# Altium project xme0724ioextend.PrjPcb
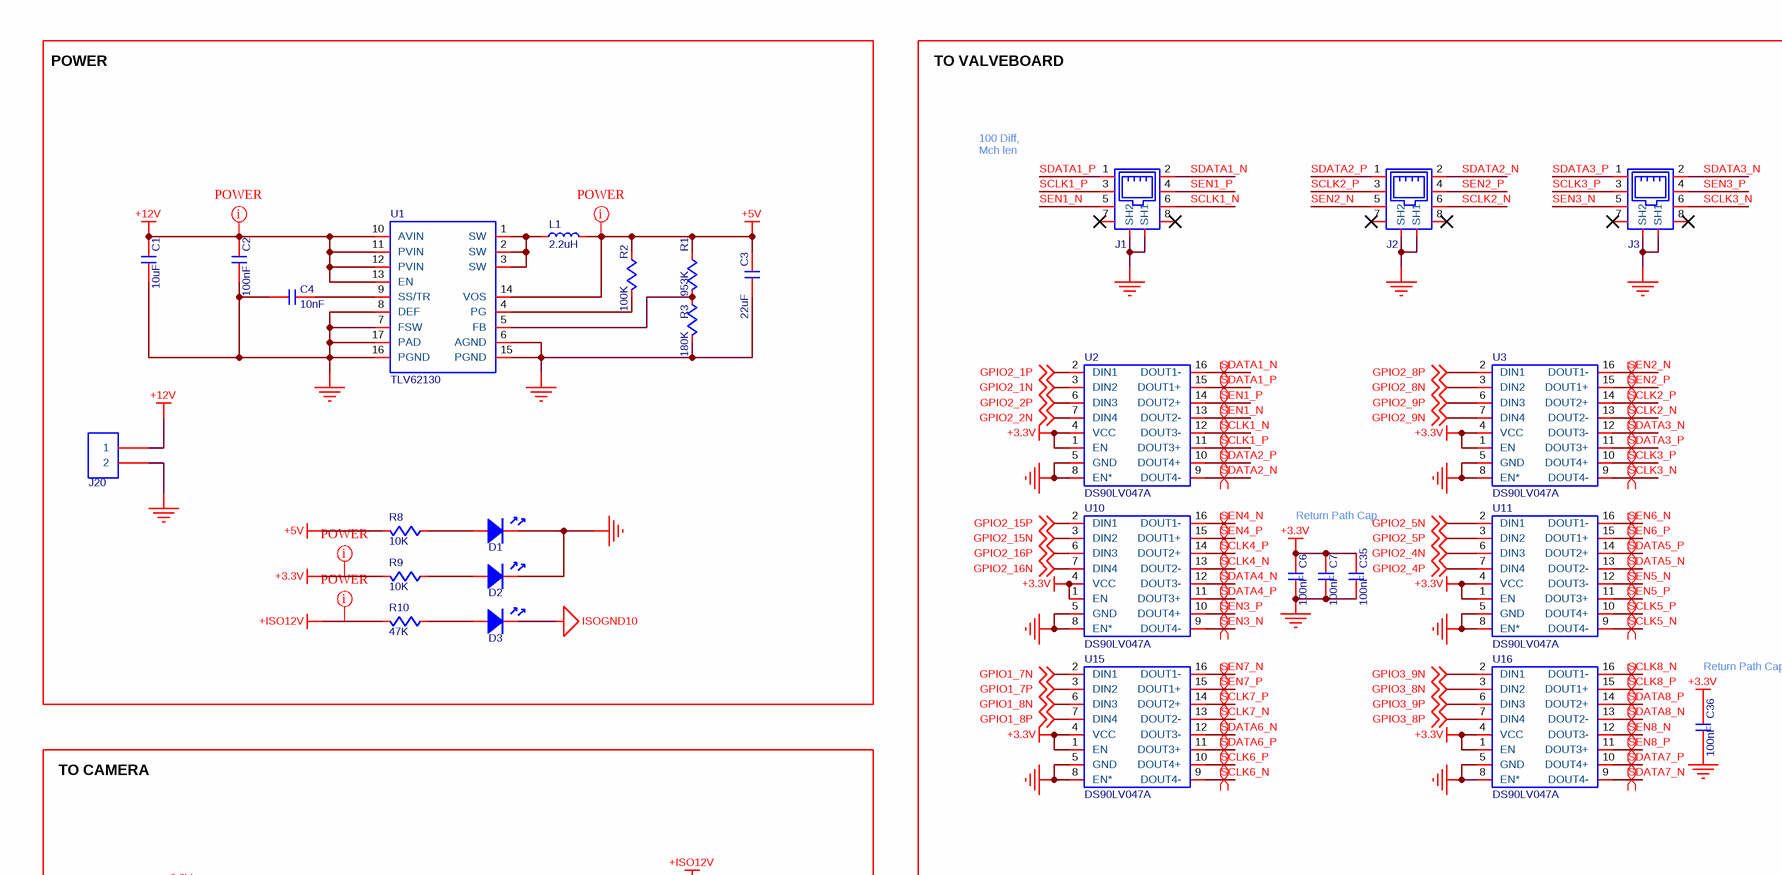
[diagram p0: Sheet.SchDoc, top left]
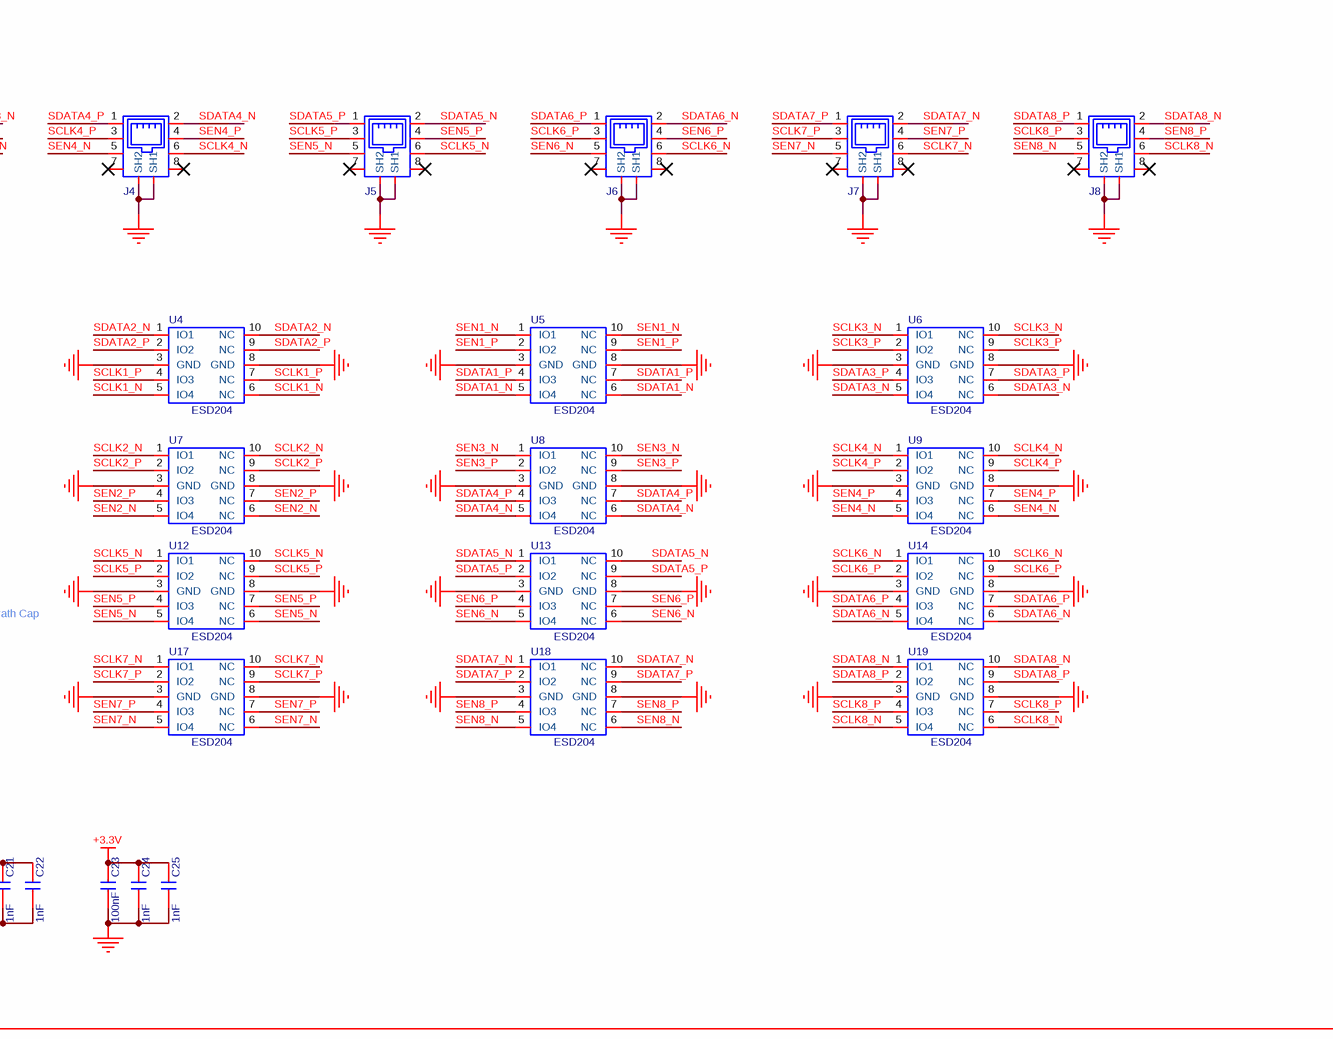
[diagram p1: Sheet.SchDoc, top right]
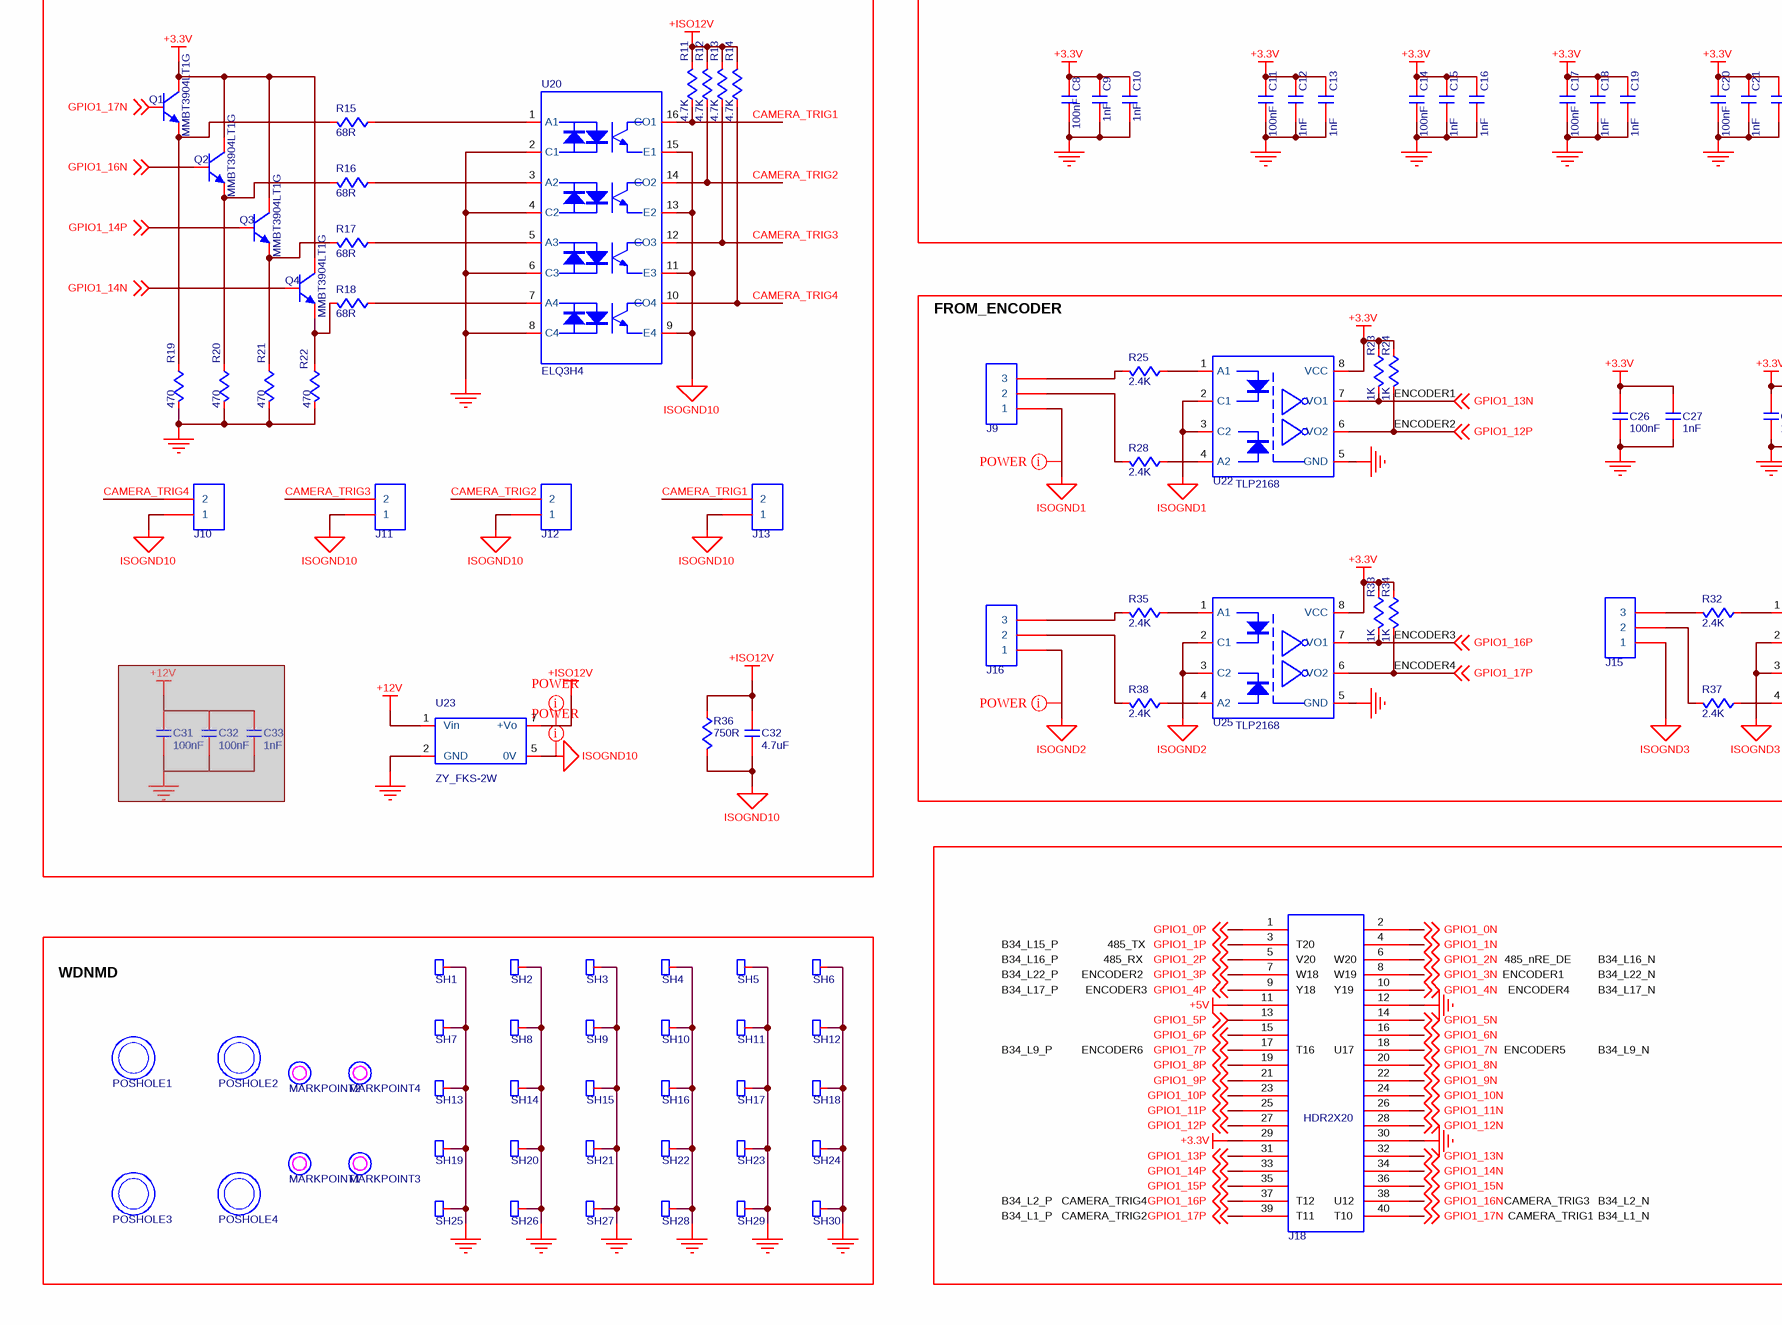
[diagram p2: Sheet.SchDoc, bottom left]
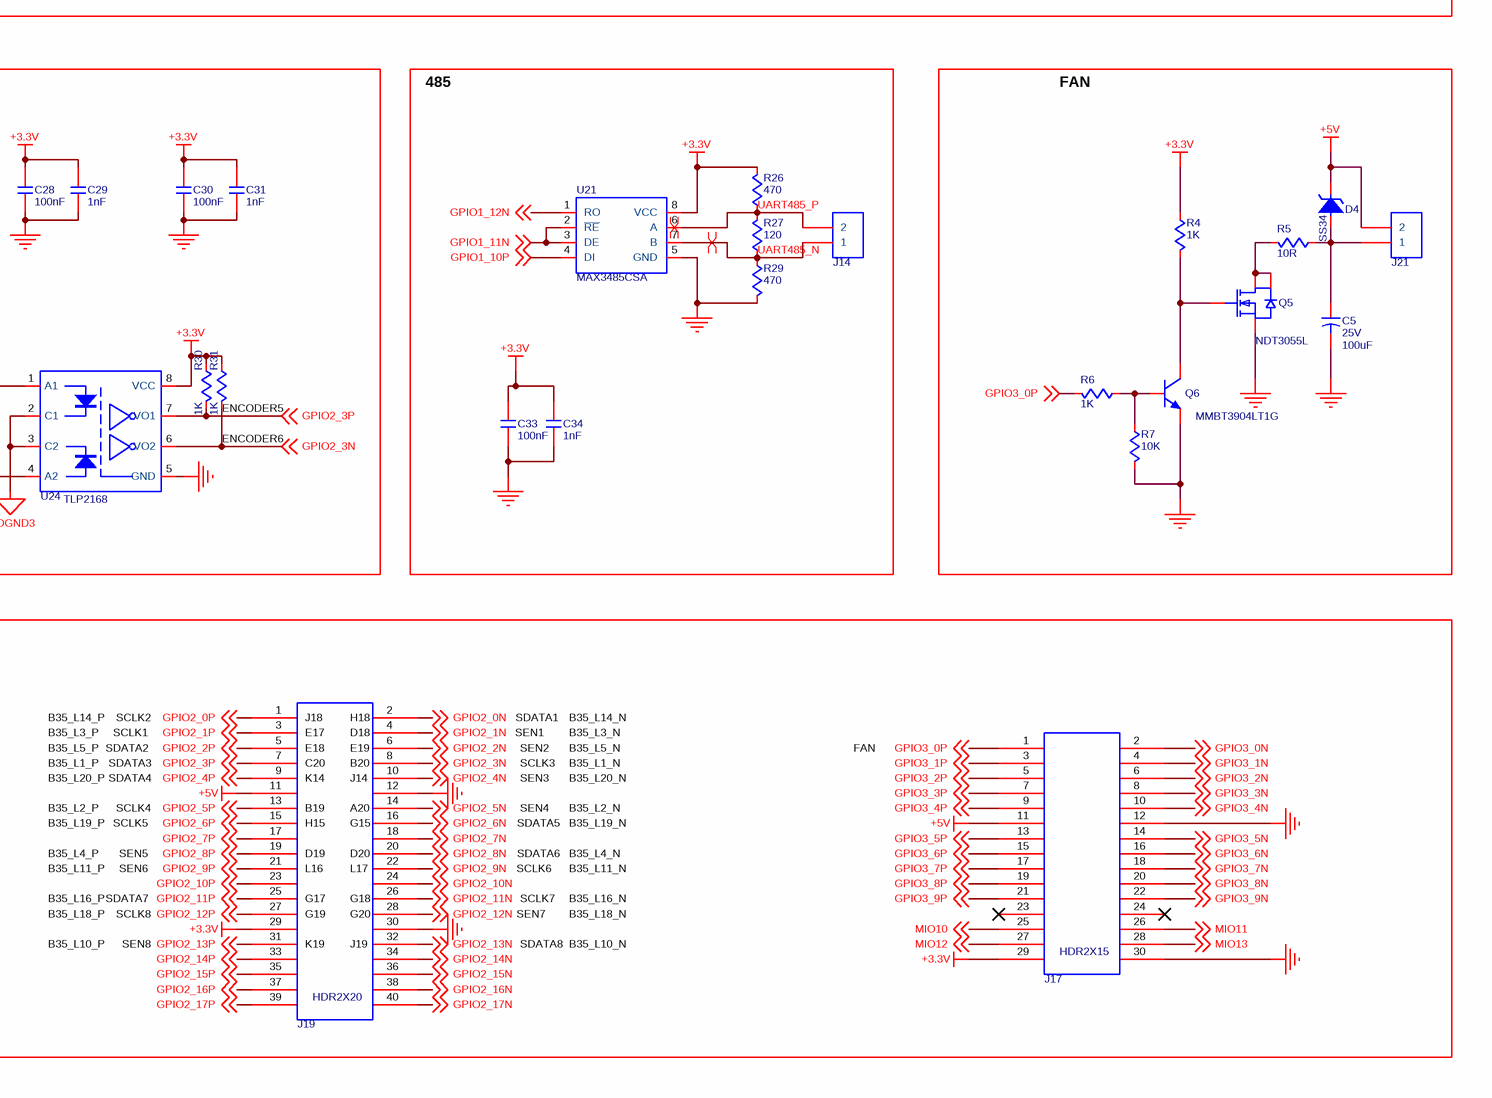
[diagram p3: Sheet.SchDoc, bottom right]
1 sheet, 172 parts. Net scope: global (net labels, ports and power ports of the same name join across sheets).
Board file: PCB.PcbDoc

## Sheet Sheet.SchDoc
size A2; SheetNumber: 1; SheetTotal: 1

### Parts
(Parts that share a designator on the sheet are numbered #1, #2 ... from top to bottom, then left to right.)
C1  value 10uF  [C0805]  (hidden comment: C-NOMO)
C2  value 100nF  [C0402]  (hidden comment: C-NOMO)
C3  value 22uF  [C0805]  (hidden comment: C-NOMO)
C4  value 10nF  [C0402]  (hidden comment: C-NOMO)
C5  value 100uF  voltage: 25V  [C7343]  (hidden comment: C-POL)
C6  value 100nF  [C0402]  (hidden comment: C-NOMO)
C7  value 100nF  [C0402]  (hidden comment: C-NOMO)
C8  value 100nF  [C0402]  (hidden comment: C-NOMO)
C9  value 1nF  [C0402]  (hidden comment: C-NOMO)
C10  value 1nF  [C0402]  (hidden comment: C-NOMO)
C11  value 100nF  [C0402]  (hidden comment: C-NOMO)
C12  value 1nF  [C0402]  (hidden comment: C-NOMO)
C13  value 1nF  [C0402]  (hidden comment: C-NOMO)
C14  value 100nF  [C0402]  (hidden comment: C-NOMO)
C15  value 1nF  [C0402]  (hidden comment: C-NOMO)
C16  value 1nF  [C0402]  (hidden comment: C-NOMO)
C17  value 100nF  [C0402]  (hidden comment: C-NOMO)
C18  value 1nF  [C0402]  (hidden comment: C-NOMO)
C19  value 1nF  [C0402]  (hidden comment: C-NOMO)
C20  value 100nF  [C0402]  (hidden comment: C-NOMO)
C21  value 1nF  [C0402]  (hidden comment: C-NOMO)
C22  value 1nF  [C0402]  (hidden comment: C-NOMO)
C23  value 100nF  [C0402]  (hidden comment: C-NOMO)
C24  value 1nF  [C0402]  (hidden comment: C-NOMO)
C25  value 1nF  [C0402]  (hidden comment: C-NOMO)
C26  value 100nF  [C0402]  (hidden comment: C-NOMO)
C27  value 1nF  [C0402]  (hidden comment: C-NOMO)
C28  value 100nF  [C0402]  (hidden comment: C-NOMO)
C29  value 1nF  [C0402]  (hidden comment: C-NOMO)
C30  value 100nF  [C0402]  (hidden comment: C-NOMO)
C31#1  value 1nF  [C0402]  (hidden comment: C-NOMO)
C31#2  value 100nF  [C0402]  (hidden comment: C-NOMO)  (masked out: inside a compile mask, not in the netlist)
C32#1  value 100nF  [C0402]  (hidden comment: C-NOMO)  (masked out: inside a compile mask, not in the netlist)
C32#2  value 4.7uF  [C0805]  (hidden comment: C-NOMO)
C33#1  value 100nF  [C0402]  (hidden comment: C-NOMO)
C33#2  value 1nF  [C0402]  (hidden comment: C-NOMO)  (masked out: inside a compile mask, not in the netlist)
C34  value 1nF  [C0402]  (hidden comment: C-NOMO)
C35  value 100nF  [C0402]  (hidden comment: C-NOMO)
C36  value 100nF  [C0402]  (hidden comment: C-NOMO)
D1  LED  [LED0603]  (value not drawn)
D2  LED  [LED0603]  (value not drawn)
D3  LED  [LED0603]  (value not drawn)
D4  SS34  [DO-214AC]
J1  RJ45-UP  [RJ45-UP]  (value not drawn)
J2  RJ45-UP  [RJ45-UP]  (value not drawn)
J3  RJ45-UP  [RJ45-UP]  (value not drawn)
J4  RJ45-UP  [RJ45-UP]  (value not drawn)
J5  RJ45-UP  [RJ45-UP]  (value not drawn)
J6  RJ45-UP  [RJ45-UP]  (value not drawn)
J7  RJ45-UP  [RJ45-UP]  (value not drawn)
J8  RJ45-UP  [RJ45-UP]  (value not drawn)
J9  HDR1X3  [KF301-5.0-3P]  (value not drawn)
J10  HDR1X2  [KF301-5.0-2P]  (value not drawn)
J11  HDR1X2  [KF301-5.0-2P]  (value not drawn)
J12  HDR1X2  [KF301-5.0-2P]  (value not drawn)
J13  HDR1X2  [KF301-5.0-2P]  (value not drawn)
J14  HDR1X2  [KF301-5.0-2P]  (value not drawn)
J15  HDR1X3  [KF301-5.0-3P]  (value not drawn)
J16  HDR1X3  [KF301-5.0-3P]  (value not drawn)
J17  HDR2X15  [HDR2X15]
J18  HDR2X20  [HDR2X20]
J19  HDR2X20  [HDR2X20]
J20  HDR1X2  [KF301-5.0-2P]  (value not drawn)
J21  HDR1X2  [XH-2A]  (value not drawn)
L1  value 2.2uH  [FXL0624]  (hidden comment: L)
MARKPOINT1  MARKPOINT  [MARKPOINT-1.0]  (value not drawn)
MARKPOINT2  MARKPOINT  [MARKPOINT-1.0]  (value not drawn)
MARKPOINT3  MARKPOINT  [MARKPOINT-1.0]  (value not drawn)
MARKPOINT4  MARKPOINT  [MARKPOINT-1.0]  (value not drawn)
POSHOLE1  POSHOLE  [POSHOLE-3.2]  (value not drawn)
POSHOLE2  POSHOLE  [POSHOLE-3.2]  (value not drawn)
POSHOLE3  POSHOLE  [POSHOLE-3.2]  (value not drawn)
POSHOLE4  POSHOLE  [POSHOLE-3.2]  (value not drawn)
Q1  MMBT3904LT1G  [SOT-23]
Q2  MMBT3904LT1G  [SOT-23]
Q3  MMBT3904LT1G  [SOT-23]
Q4  MMBT3904LT1G  [SOT-23]
Q5  NDT3055L  [SOT-223]
Q6  MMBT3904LT1G  [SOT-23]
R1  value 953K  [R0402]  (hidden comment: R)
R2  value 100K  [R0402]  (hidden comment: R)
R3  value 180K  [R0402]  (hidden comment: R)
R4  value 1K  [R0402]  (hidden comment: R)
R5  value 10R  [R1812]  (hidden comment: R)
R6  value 1K  [R0402]  (hidden comment: R)
R7  value 10K  [R0402]  (hidden comment: R)
R8  value 10K  [R0402]  (hidden comment: R)
R9  value 10K  [R0402]  (hidden comment: R)
R10  value 47K  [R0402]  (hidden comment: R)
R11  value 4.7K  [R0402]  (hidden comment: R)
R12  value 4.7K  [R0402]  (hidden comment: R)
R13  value 4.7K  [R0402]  (hidden comment: R)
R14  value 4.7K  [R0402]  (hidden comment: R)
R15  value 68R  [R0402]  (hidden comment: R)
R16  value 68R  [R0402]  (hidden comment: R)
R17  value 68R  [R0402]  (hidden comment: R)
R18  value 68R  [R0402]  (hidden comment: R)
R19  value 470  [R0402]  (hidden comment: R)
R20  value 470  [R0402]  (hidden comment: R)
R21  value 470  [R0402]  (hidden comment: R)
R22  value 470  [R0402]  (hidden comment: R)
R23  value 1K  [R0402]  (hidden comment: R)
R24  value 1K  [R0402]  (hidden comment: R)
R25  value 2.4K  [R2512]  (hidden comment: R)
R26  value 470  [R0402]  (hidden comment: R)
R27  value 120  [R0402]  (hidden comment: R)
R28  value 2.4K  [R2512]  (hidden comment: R)
R29  value 470  [R0402]  (hidden comment: R)
R30  value 1K  [R0402]  (hidden comment: R)
R31  value 1K  [R0402]  (hidden comment: R)
R32  value 2.4K  [R2512]  (hidden comment: R)
R33  value 1K  [R0402]  (hidden comment: R)
R34  value 1K  [R0402]  (hidden comment: R)
R35  value 2.4K  [R2512]  (hidden comment: R)
R36  value 750R  [R2512]  (hidden comment: R)
R37  value 2.4K  [R2512]  (hidden comment: R)
R38  value 2.4K  [R2512]  (hidden comment: R)
SH1  SHIELDSUPPORT  [SHIELDSUPPORT1]  (value not drawn)
SH2  SHIELDSUPPORT  [SHIELDSUPPORT1]  (value not drawn)
SH3  SHIELDSUPPORT  [SHIELDSUPPORT1]  (value not drawn)
SH4  SHIELDSUPPORT  [SHIELDSUPPORT1]  (value not drawn)
SH5  SHIELDSUPPORT  [SHIELDSUPPORT1]  (value not drawn)
SH6  SHIELDSUPPORT  [SHIELDSUPPORT1]  (value not drawn)
SH7  SHIELDSUPPORT  [SHIELDSUPPORT1]  (value not drawn)
SH8  SHIELDSUPPORT  [SHIELDSUPPORT1]  (value not drawn)
SH9  SHIELDSUPPORT  [SHIELDSUPPORT1]  (value not drawn)
SH10  SHIELDSUPPORT  [SHIELDSUPPORT1]  (value not drawn)
SH11  SHIELDSUPPORT  [SHIELDSUPPORT1]  (value not drawn)
SH12  SHIELDSUPPORT  [SHIELDSUPPORT1]  (value not drawn)
SH13  SHIELDSUPPORT  [SHIELDSUPPORT1]  (value not drawn)
SH14  SHIELDSUPPORT  [SHIELDSUPPORT1]  (value not drawn)
SH15  SHIELDSUPPORT  [SHIELDSUPPORT1]  (value not drawn)
SH16  SHIELDSUPPORT  [SHIELDSUPPORT1]  (value not drawn)
SH17  SHIELDSUPPORT  [SHIELDSUPPORT1]  (value not drawn)
SH18  SHIELDSUPPORT  [SHIELDSUPPORT1]  (value not drawn)
SH19  SHIELDSUPPORT  [SHIELDSUPPORT1]  (value not drawn)
SH20  SHIELDSUPPORT  [SHIELDSUPPORT1]  (value not drawn)
SH21  SHIELDSUPPORT  [SHIELDSUPPORT1]  (value not drawn)
SH22  SHIELDSUPPORT  [SHIELDSUPPORT1]  (value not drawn)
SH23  SHIELDSUPPORT  [SHIELDSUPPORT1]  (value not drawn)
SH24  SHIELDSUPPORT  [SHIELDSUPPORT1]  (value not drawn)
SH25  SHIELDSUPPORT  [SHIELDSUPPORT1]  (value not drawn)
SH26  SHIELDSUPPORT  [SHIELDSUPPORT1]  (value not drawn)
SH27  SHIELDSUPPORT  [SHIELDSUPPORT1]  (value not drawn)
SH28  SHIELDSUPPORT  [SHIELDSUPPORT1]  (value not drawn)
SH29  SHIELDSUPPORT  [SHIELDSUPPORT1]  (value not drawn)
SH30  SHIELDSUPPORT  [SHIELDSUPPORT1]  (value not drawn)
U1  TLV62130  [TLV62130]
U2  DS90LV047A  [DS90LV047]
U3  DS90LV047A  [DS90LV047]
U4  ESD204  [ESD204]
U5  ESD204  [ESD204]
U6  ESD204  [ESD204]
U7  ESD204  [ESD204]
U8  ESD204  [ESD204]
U9  ESD204  [ESD204]
U10  DS90LV047A  [DS90LV047]
U11  DS90LV047A  [DS90LV047]
U12  ESD204  [ESD204]
U13  ESD204  [ESD204]
U14  ESD204  [ESD204]
U15  DS90LV047A  [DS90LV047]
U16  DS90LV047A  [DS90LV047]
U17  ESD204  [ESD204]
U18  ESD204  [ESD204]
U19  ESD204  [ESD204]
U20  ELQ3H4  [ELQ3H4]
U21  MAX3485CSA  [MAX3485CSA]
U22  TLP2168  [TLP2168]
U23  ZY_FKS-2W  [ZY_FKS-2W]
U24  TLP2168  [TLP2168]
U25  TLP2168  [TLP2168]

### Blocks framed on the sheet
POWER: C1-C4 D1-D3 J20 L1 R1-R3 R8-R10 U1
TO VALVEBOARD: C6-C25 C35 C36 J1-J8 U2-U19
TO CAMERA: C31#2 C32#1 C32#2 C33#2 J10-J13 Q1-Q4 R11-R22 R36 U20 U23
FROM_ENCODER: C26-C30 C31#1 J9 J15 J16 R23-R25 R28 R30-R35 R37 R38 U22 U24 U25
485: C33#1 C34 J14 R26 R27 R29 U21
FAN: C5 D4 J21 Q5 Q6 R4-R7
WDNMD: MARKPOINT1-MARKPOINT4 POSHOLE1-POSHOLE4 SH1-SH30

### Nets
+3.3V: C6.2 C7.2 C8.2 C9.2 C10.2 C11.2 C12.2 C13.2 C14.2 C15.2 C16.2 C17.2 C18.2 C19.2 C20.2 C21.2 C22.2 C23.2 C24.2 C25.2 C26.2 C27.2 C28.2 C29.2 C30.2 C31#1.2 C33#1.2 C34.2 C35.2 C36.2 J17.29 J18.29 J19.29 Q1.3(C) Q2.3(C) Q3.3(C) Q4.3(C) R4.2 R9.1 R23.2 R24.2 R26.1 R30.2 R31.2 R33.2 R34.2 U2.1(EN) U2.4(VCC) U3.1(EN) U3.4(VCC) U10.1(EN) U10.4(VCC) U11.1(EN) U11.4(VCC) U15.1(EN) U15.4(VCC) U16.1(EN) U16.4(VCC) U21.8(VCC) U22.8(VCC) U24.8(VCC) U25.8(VCC)
+5V: C3.1 D4.1 J17.11 J18.11 J19.11 J21.2 L1.2 R1.2 R2.2 R8.1 U1.14(VOS)
+12V: C1.2 C2.2 J20.1 U1.10(AVIN) U1.11(PVIN) U1.12(PVIN) U1.13(EN) U23.1(Vin)
+ISO12V: C32#2.2 R10.1 R11.1 R12.1 R13.1 R14.1 R36.2 U23.7(+Vo)
GND: C1.1 C2.1 C3.2 C4.2 C5.2 C6.1 C7.1 C8.1 C9.1 C10.1 C11.1 C12.1 C13.1 C14.1 C15.1 C16.1 C17.1 C18.1 C19.1 C20.1 C21.1 C22.1 C23.1 C24.1 C25.1 C26.1 C27.1 C28.1 C29.1 C30.1 C31#1.1 C33#1.1 C34.1 C35.1 C36.1 D1.1 D2.1 J1.SH1 J1.SH2 J2.SH1 J2.SH2 J3.SH1 J3.SH2 J4.SH1 J4.SH2 J5.SH1 J5.SH2 J6.SH1 J6.SH2 J7.SH1 J7.SH2 J8.SH1 J8.SH2 J17.12 J17.30 J18.12 J18.30 J19.12 J19.30 J20.2 Q5.3(S) Q6.2(E) R3.1 R7.1 R19.1 R20.1 R21.1 R22.1 R29.1 SH1.SH SH2.SH SH3.SH SH4.SH SH5.SH SH6.SH SH7.SH SH8.SH SH9.SH SH10.SH SH11.SH SH12.SH SH13.SH SH14.SH SH15.SH SH16.SH SH17.SH SH18.SH SH19.SH SH20.SH SH21.SH SH22.SH SH23.SH SH24.SH SH25.SH SH26.SH SH27.SH SH28.SH SH29.SH SH30.SH U1.6(AGND) U1.7(FSW) U1.8(DEF) U1.15(PGND) U1.16(PGND) U1.17(PAD) U2.5(GND) U2.8(EN*) U3.5(GND) U3.8(EN*) U4.3(GND) U4.8(GND) U5.3(GND) U5.8(GND) U6.3(GND) U6.8(GND) U7.3(GND) U7.8(GND) U8.3(GND) U8.8(GND) U9.3(GND) U9.8(GND) U10.5(GND) U10.8(EN*) U11.5(GND) U11.8(EN*) U12.3(GND) U12.8(GND) U13.3(GND) U13.8(GND) U14.3(GND) U14.8(GND) U15.5(GND) U15.8(EN*) U16.5(GND) U16.8(EN*) U17.3(GND) U17.8(GND) U18.3(GND) U18.8(GND) U19.3(GND) U19.8(GND) U20.2(C1) U20.4(C2) U20.6(C3) U20.8(C4) U21.5(GND) U22.5(GND) U23.2(GND) U24.5(GND) U25.5(GND)
ISOGND1: J9.1 U22.2(C1) U22.3(C2)
ISOGND2: J16.1 U25.2(C1) U25.3(C2)
ISOGND3: J15.1 U24.2(C1) U24.3(C2)
ISOGND10: C32#2.1 D3.1 J10.1 J11.1 J12.1 J13.1 R36.1 U20.9(E4) U20.11(E3) U20.13(E2) U20.15(E1) U23.5(0V)
CAMERA_TRIG1: J13.2 R11.2 U20.16(CO1)
CAMERA_TRIG2: J12.2 R12.2 U20.14(CO2)
CAMERA_TRIG3: J11.2 R13.2 U20.12(CO3)
CAMERA_TRIG4: J10.2 R14.2 U20.10(CO4)
GPIO1_0N: J18.2 ; off-sheet GPIO1_0N
GPIO1_0P: J18.1 ; off-sheet GPIO1_0P
GPIO1_1N: J18.4 ; off-sheet GPIO1_1N
GPIO1_1P: J18.3 ; off-sheet GPIO1_1P
GPIO1_2N: J18.6 ; off-sheet GPIO1_2N
GPIO1_2P: J18.5 ; off-sheet GPIO1_2P
GPIO1_3N: J18.8 ; off-sheet GPIO1_3N
GPIO1_3P: J18.7 ; off-sheet GPIO1_3P
GPIO1_4N: J18.10 ; off-sheet GPIO1_4N
GPIO1_4P: J18.9 ; off-sheet GPIO1_4P
GPIO1_5N: J18.14 ; off-sheet GPIO1_5N
GPIO1_5P: J18.13 ; off-sheet GPIO1_5P
GPIO1_6N: J18.16 ; off-sheet GPIO1_6N
GPIO1_6P: J18.15 ; off-sheet GPIO1_6P
GPIO1_7N: J18.18 U15.2(DIN1) ; off-sheet GPIO1_7N
GPIO1_7P: J18.17 U15.3(DIN2) ; off-sheet GPIO1_7P
GPIO1_8N: J18.20 U15.6(DIN3) ; off-sheet GPIO1_8N
GPIO1_8P: J18.19 U15.7(DIN4) ; off-sheet GPIO1_8P
GPIO1_9N: J18.22 ; off-sheet GPIO1_9N
GPIO1_9P: J18.21 ; off-sheet GPIO1_9P
GPIO1_10N: J18.24 ; off-sheet GPIO1_10N
GPIO1_10P: J18.23 U21.4(DI) ; off-sheet GPIO1_10P
GPIO1_11N: J18.26 U21.2(~{RE}) U21.3(DE) ; off-sheet GPIO1_11N
GPIO1_11P: J18.25 ; off-sheet GPIO1_11P
GPIO1_12N: J18.28 U21.1(RO) ; off-sheet GPIO1_12N
GPIO1_12P: J18.27 R24.1 U22.6(VO2) ; off-sheet GPIO1_12P
GPIO1_13N: J18.32 R23.1 U22.7(VO1) ; off-sheet GPIO1_13N
GPIO1_13P: J18.31 ; off-sheet GPIO1_13P
GPIO1_14N: J18.34 Q4.1(B) ; off-sheet GPIO1_14N
GPIO1_14P: J18.33 Q3.1(B) ; off-sheet GPIO1_14P
GPIO1_15N: J18.36 ; off-sheet GPIO1_15N
GPIO1_15P: J18.35 ; off-sheet GPIO1_15P
GPIO1_16N: J18.38 Q2.1(B) ; off-sheet GPIO1_16N
GPIO1_16P: J18.37 R33.1 U25.7(VO1) ; off-sheet GPIO1_16P
GPIO1_17N: J18.40 Q1.1(B) ; off-sheet GPIO1_17N
GPIO1_17P: J18.39 R34.1 U25.6(VO2) ; off-sheet GPIO1_17P
GPIO2_0N: J19.2 ; off-sheet GPIO2_0N
GPIO2_0P: J19.1 ; off-sheet GPIO2_0P
GPIO2_1N: J19.4 U2.3(DIN2) ; off-sheet GPIO2_1N
GPIO2_1P: J19.3 U2.2(DIN1) ; off-sheet GPIO2_1P
GPIO2_2N: J19.6 U2.7(DIN4) ; off-sheet GPIO2_2N
GPIO2_2P: J19.5 U2.6(DIN3) ; off-sheet GPIO2_2P
GPIO2_3N: J19.8 R31.1 U24.6(VO2) ; off-sheet GPIO2_3N
GPIO2_3P: J19.7 R30.1 U24.7(VO1) ; off-sheet GPIO2_3P
GPIO2_4N: J19.10 U11.6(DIN3) ; off-sheet GPIO2_4N
GPIO2_4P: J19.9 U11.7(DIN4) ; off-sheet GPIO2_4P
GPIO2_5N: J19.14 U11.2(DIN1) ; off-sheet GPIO2_5N
GPIO2_5P: J19.13 U11.3(DIN2) ; off-sheet GPIO2_5P
GPIO2_6N: J19.16 ; off-sheet GPIO2_6N
GPIO2_6P: J19.15 ; off-sheet GPIO2_6P
GPIO2_7N: J19.18 ; off-sheet GPIO2_7N
GPIO2_7P: J19.17 ; off-sheet GPIO2_7P
GPIO2_8N: J19.20 U3.3(DIN2) ; off-sheet GPIO2_8N
GPIO2_8P: J19.19 U3.2(DIN1) ; off-sheet GPIO2_8P
GPIO2_9N: J19.22 U3.7(DIN4) ; off-sheet GPIO2_9N
GPIO2_9P: J19.21 U3.6(DIN3) ; off-sheet GPIO2_9P
GPIO2_10N: J19.24 ; off-sheet GPIO2_10N
GPIO2_10P: J19.23 ; off-sheet GPIO2_10P
GPIO2_11N: J19.26 ; off-sheet GPIO2_11N
GPIO2_11P: J19.25 ; off-sheet GPIO2_11P
GPIO2_12N: J19.28 ; off-sheet GPIO2_12N
GPIO2_12P: J19.27 ; off-sheet GPIO2_12P
GPIO2_13N: J19.32 ; off-sheet GPIO2_13N
GPIO2_13P: J19.31 ; off-sheet GPIO2_13P
GPIO2_14N: J19.34 ; off-sheet GPIO2_14N
GPIO2_14P: J19.33 ; off-sheet GPIO2_14P
GPIO2_15N: J19.36 U10.3(DIN2) ; off-sheet GPIO2_15N
GPIO2_15P: J19.35 U10.2(DIN1) ; off-sheet GPIO2_15P
GPIO2_16N: J19.38 U10.7(DIN4) ; off-sheet GPIO2_16N
GPIO2_16P: J19.37 U10.6(DIN3) ; off-sheet GPIO2_16P
GPIO2_17N: J19.40 ; off-sheet GPIO2_17N
GPIO2_17P: J19.39 ; off-sheet GPIO2_17P
GPIO3_0N: J17.2 ; off-sheet GPIO3_0N
GPIO3_0P: J17.1 R6.1 ; off-sheet GPIO3_0P
GPIO3_1N: J17.4 ; off-sheet GPIO3_1N
GPIO3_1P: J17.3 ; off-sheet GPIO3_1P
GPIO3_2N: J17.6 ; off-sheet GPIO3_2N
GPIO3_2P: J17.5 ; off-sheet GPIO3_2P
GPIO3_3N: J17.8 ; off-sheet GPIO3_3N
GPIO3_3P: J17.7 ; off-sheet GPIO3_3P
GPIO3_4N: J17.10 ; off-sheet GPIO3_4N
GPIO3_4P: J17.9 ; off-sheet GPIO3_4P
GPIO3_5N: J17.14 ; off-sheet GPIO3_5N
GPIO3_5P: J17.13 ; off-sheet GPIO3_5P
GPIO3_6N: J17.16 ; off-sheet GPIO3_6N
GPIO3_6P: J17.15 ; off-sheet GPIO3_6P
GPIO3_7N: J17.18 ; off-sheet GPIO3_7N
GPIO3_7P: J17.17 ; off-sheet GPIO3_7P
GPIO3_8N: J17.20 U16.3(DIN2) ; off-sheet GPIO3_8N
GPIO3_8P: J17.19 U16.7(DIN4) ; off-sheet GPIO3_8P
GPIO3_9N: J17.22 U16.2(DIN1) ; off-sheet GPIO3_9N
GPIO3_9P: J17.21 U16.6(DIN3) ; off-sheet GPIO3_9P
MIO10: J17.25 ; off-sheet MIO10
MIO11: J17.26 ; off-sheet MIO11
MIO12: J17.27 ; off-sheet MIO12
MIO13: J17.28 ; off-sheet MIO13
SCLK1_N: J1.6 U2.12(DOUT3-) U4.5(IO4) U4.6(NC)
SCLK1_P: J1.3 U2.11(DOUT3+) U4.4(IO3) U4.7(NC)
SCLK2_N: J2.6 U3.13(DOUT2-) U7.1(IO1) U7.10(NC)
SCLK2_P: J2.3 U3.14(DOUT2+) U7.2(IO2) U7.9(NC)
SCLK3_N: J3.6 U3.9(DOUT4-) U6.1(IO1) U6.10(NC)
SCLK3_P: J3.3 U3.10(DOUT4+) U6.2(IO2) U6.9(NC)
SCLK4_N: J4.6 U9.1(IO1) U9.10(NC) U10.13(DOUT2-)
SCLK4_P: J4.3 U9.2(IO2) U9.9(NC) U10.14(DOUT2+)
SCLK5_N: J5.6 U11.9(DOUT4-) U12.1(IO1) U12.10(NC)
SCLK5_P: J5.3 U11.10(DOUT4+) U12.2(IO2) U12.9(NC)
SCLK6_N: J6.6 U14.1(IO1) U14.10(NC) U15.9(DOUT4-)
SCLK6_P: J6.3 U14.2(IO2) U14.9(NC) U15.10(DOUT4+)
SCLK7_N: J7.6 U15.13(DOUT2-) U17.1(IO1) U17.10(NC)
SCLK7_P: J7.3 U15.14(DOUT2+) U17.2(IO2) U17.9(NC)
SCLK8_N: J8.6 U16.16(DOUT1-) U19.5(IO4) U19.6(NC)
SCLK8_P: J8.3 U16.15(DOUT1+) U19.4(IO3) U19.7(NC)
SDATA1_N: J1.2 U2.16(DOUT1-) U5.5(IO4) U5.6(NC)
SDATA1_P: J1.1 U2.15(DOUT1+) U5.4(IO3) U5.7(NC)
SDATA2_N: J2.2 U2.9(DOUT4-) U4.1(IO1) U4.10(NC)
SDATA2_P: J2.1 U2.10(DOUT4+) U4.2(IO2) U4.9(NC)
SDATA3_N: J3.2 U3.12(DOUT3-) U6.5(IO4) U6.6(NC)
SDATA3_P: J3.1 U3.11(DOUT3+) U6.4(IO3) U6.7(NC)
SDATA4_N: J4.2 U8.5(IO4) U8.6(NC) U10.12(DOUT3-)
SDATA4_P: J4.1 U8.4(IO3) U8.7(NC) U10.11(DOUT3+)
SDATA5_N: J5.2 U11.13(DOUT2-) U13.1(IO1) U13.10(NC)
SDATA5_P: J5.1 U11.14(DOUT2+) U13.2(IO2) U13.9(NC)
SDATA6_N: J6.2 U14.5(IO4) U14.6(NC) U15.12(DOUT3-)
SDATA6_P: J6.1 U14.4(IO3) U14.7(NC) U15.11(DOUT3+)
SDATA7_N: J7.2 U16.9(DOUT4-) U18.1(IO1) U18.10(NC)
SDATA7_P: J7.1 U16.10(DOUT4+) U18.2(IO2) U18.9(NC)
SDATA8_N: J8.2 U16.13(DOUT2-) U19.1(IO1) U19.10(NC)
SDATA8_P: J8.1 U16.14(DOUT2+) U19.2(IO2) U19.9(NC)
SEN1_N: J1.5 U2.13(DOUT2-) U5.1(IO1) U5.10(NC)
SEN1_P: J1.4 U2.14(DOUT2+) U5.2(IO2) U5.9(NC)
SEN2_N: J2.5 U3.16(DOUT1-) U7.5(IO4) U7.6(NC)
SEN2_P: J2.4 U3.15(DOUT1+) U7.4(IO3) U7.7(NC)
SEN3_N: J3.5 U8.1(IO1) U8.10(NC) U10.9(DOUT4-)
SEN3_P: J3.4 U8.2(IO2) U8.9(NC) U10.10(DOUT4+)
SEN4_N: J4.5 U9.5(IO4) U9.6(NC) U10.16(DOUT1-)
SEN4_P: J4.4 U9.4(IO3) U9.7(NC) U10.15(DOUT1+)
SEN5_N: J5.5 U11.12(DOUT3-) U12.5(IO4) U12.6(NC)
SEN5_P: J5.4 U11.11(DOUT3+) U12.4(IO3) U12.7(NC)
SEN6_N: J6.5 U11.16(DOUT1-) U13.5(IO4) U13.6(NC)
SEN6_P: J6.4 U11.15(DOUT1+) U13.4(IO3) U13.7(NC)
SEN7_N: J7.5 U15.16(DOUT1-) U17.5(IO4) U17.6(NC)
SEN7_P: J7.4 U15.15(DOUT1+) U17.4(IO3) U17.7(NC)
SEN8_N: J8.5 U16.12(DOUT3-) U18.5(IO4) U18.6(NC)
SEN8_P: J8.4 U16.11(DOUT3+) U18.4(IO3) U18.7(NC)
UART485_N: J14.1 R27.2 R29.2 U21.7(B)
UART485_P: J14.2 R26.2 R27.1 U21.6(A)
NetC4_1: C4.1 U1.9(SS/TR)
NetC5_1: C5.1 D4.2 J21.1 R5.2
NetD1_2: D1.2 R8.2
NetD2_2: D2.2 R9.2
NetD3_2: D3.2 R10.2
NetJ9_2: J9.2 R28.1
NetJ9_3: J9.3 R25.1
NetJ15_2: J15.2 R37.1
NetJ15_3: J15.3 R32.1
NetJ16_2: J16.2 R38.1
NetJ16_3: J16.3 R35.1
NetL1_1: L1.1 U1.1(SW) U1.2(SW) U1.3(SW)
NetQ1_2: Q1.2(E) R15.1 R19.2
NetQ2_2: Q2.2(E) R16.1 R20.2
NetQ3_2: Q3.2(E) R17.1 R21.2
NetQ4_2: Q4.2(E) R18.1 R22.2
NetQ5_1: Q5.1(G) Q6.3(C) R4.1
NetQ5_2: Q5.2(D) Q5.4(D) R5.1
NetQ6_1: Q6.1(B) R6.2 R7.2
NetR1_1: R1.1 R3.2 U1.5(FB)
NetR2_1: R2.1 U1.4(PG)
NetR15_2: R15.2 U20.1(A1)
NetR16_2: R16.2 U20.3(A2)
NetR17_2: R17.2 U20.5(A3)
NetR18_2: R18.2 U20.7(A4)
NetR25_2: R25.2 U22.1(A1)
NetR28_2: R28.2 U22.4(A2)
NetR32_2: R32.2 U24.1(A1)
NetR35_2: R35.2 U25.1(A1)
NetR37_2: R37.2 U24.4(A2)
NetR38_2: R38.2 U25.4(A2)

Not connected (* = marked no-connect by the designer): J1 7* 8*; J2 7* 8*; J3 7* 8*; J4 7* 8*; J5 7* 8*; J6 7* 8*; J7 7* 8*; J8 7* 8*; J17 23* 24*

### Layout directives
differential pair; differential pair class VALVEBOARD2: SCLK3_N, SCLK3_P, SDATA1_N, SDATA1_P, SDATA3_N, SDATA3_P
differential pair; differential pair class VALVEBOARD1: SCLK1_N, SCLK1_P, SDATA2_N, SDATA2_P, SEN1_N, SEN1_P
differential pair; differential pair class VALVEBOARD3: SCLK2_N, SCLK2_P, SEN2_N, SEN2_P, SEN3_N, SEN3_P
differential pair; differential pair class UART485: UART485_N, UART485_P
net class POWER: +3.3V, +5V, +12V, +ISO12V, ISOGND1, ISOGND2, ISOGND10
differential pair; differential pair class VALVEBOARD4: SCLK4_N, SCLK4_P, SDATA4_N, SDATA4_P, SEN4_N, SEN4_P
differential pair; differential pair class VALVEBOARD6: SCLK6_N, SCLK6_P, SDATA6_N, SDATA6_P, SEN6_N, SEN6_P
differential pair; differential pair class VALVEBOARD5: SCLK5_N, SCLK5_P, SDATA5_N, SDATA5_P, SEN5_N, SEN5_P
differential pair; differential pair class VALVEBOARD7: SCLK7_N, SCLK7_P, SDATA7_N, SDATA7_P, SEN7_N, SEN7_P
differential pair; differential pair class VALVEBOARD8: SCLK8_N, SCLK8_P, SDATA8_N, SDATA8_P, SEN8_N, SEN8_P

### Notes on the sheet
- 100 Diff, Mch len
- Return Path Cap
- (near C36) Return Path Cap
- ENCODER2
- (near R24) ENCODER1
- ENCODER4
- (near R34) ENCODER3
- ENCODER6
- (near R31) ENCODER5
- B34_L15_P
- B34_L16_P
- B34_L22_P
- 485_TX
- 485_RX
- (near J18) T20
- (near J18) V20
- (near J18) W18
- (near J18) W19
- (near J18) W20
- ENCODER1
- 485_nRE_DE
- B34_L16_N
- B34_L22_N
- B35_L14_P
- B35_L3_P
- B35_L5_P
- SCLK2
- SDATA2
- SCLK1
- (near J19) J18
- (near J19) E17
- (near J19) E18
- (near J19) H18
- (near J19) D18
- (near J19) E19
- SEN2
- SEN1
- SDATA1
- B35_L14_N
- B35_L3_N
- B35_L5_N
- FAN
- B34_L17_P
- B34_L9_P
- ENCODER3
- (near J18) Y18
- (near J18) T16
- (near J18) Y19
- (near J18) U17
- ENCODER5
- B34_L17_N
- B34_L9_N
- B35_L1_P
- B35_L20_P
- B35_L2_P
- B35_L19_P
- SDATA3
- SDATA4
- SCLK4
- SCLK5
- (near J19) C20
- (near J19) K14
- (near J19) B19
- (near J19) H15
- (near J19) B20
- (near J19) J14
- (near J19) A20
- (near J19) G15
- SCLK3
- SEN4
- SEN3
- SDATA5
- B35_L1_N
- B35_L20_N
- B35_L2_N
- B35_L19_N
- B35_L4_P
- B35_L11_P
- B35_L16_P
- SEN6
- SDATA7
- SEN5
- (near J19) D19
- (near J19) L16
- (near J19) G17
- (near J19) D20
- (near J19) L17
- (near J19) G18
- SCLK7
- SCLK6
- SDATA6
- B35_L4_N
- B35_L11_N
- B35_L16_N
- B34_L2_P
- B34_L1_P
- CAMERA_TRIG4
- CAMERA_TRIG2
- (near J18) T12
- (near J18) T11
- (near J18) U12
- (near J18) T10
- CAMERA_TRIG1
- CAMERA_TRIG3
- B34_L2_N
- B34_L1_N
- B35_L18_P
- B35_L10_P
- SCLK8
- SEN8
- (near J19) G19
- (near J19) K19
- (near J19) G20
- (near J19) J19
- SDATA8
- SEN7
- B35_L18_N
- B35_L10_N

### Library data of the parts
C1-C4 C6-C30 C31#1 C31#2 C32#1 C32#2 C33#1 C33#2 C34-C36 = C-NOMO: voltage: 25V; precision: 5%
D4 = DIOD2
L1 = L: Code_IEC: 1005; Published: 8-Jun-2000; LatestRevisionDate: 29-May-2009; LatestRevisionNote: IPC-7351 Footprint Added.; PackageReference: 0402-A; Publisher: Altium Limited; PackageDescription: Chip Inductor; Code_JEITA: 0402
Q1-Q4 Q6 = NPN: Supplier 1: LCSC; Supplier Part Number 1: C260863
R1-R38 = R: precision: 1%
J1-J8 = RJ45-UP: Supplier 1: LCSC; Supplier Part Number 1: C2683357
J9 J15 J16 = HDR1X3: Supplier 1: LCSC; Supplier Part Number 1: C474884; Supplier 2: LCSC; Supplier Part Number 2: C609572
J10-J14 J20 J21 = HDR1X2: Supplier 1: LCSC; Supplier Part Number 1: C474881; Supplier 2: LCSC; Supplier Part Number 2: C225477; Supplier 3: LCSC; Supplier Part Number 3: C20079
J17 = HDR2X15: Supplier 1: LCSC; Supplier Part Number 1: C124359; Supplier 2: LCSC; Supplier Part Number 2: C3405
J18 J19 = HDR2X20: Supplier 1: LCSC; Supplier Part Number 1: C124383
Q5 = NDT3055L: Supplier 1: LCSC; Supplier Part Number 1: C725128
U1 = TLV62130: Supplier 1: LCSC; Supplier Part Number 1: C122479
U2 U3 U10 U11 U15 U16 = DS90LV047A: Supplier Part Number 1: C87097; Supplier 1: LCSC
U4-U9 U12-U14 U17-U19 = ESD204: Supplier 1: LCSC; Supplier Part Number 1: C553132
U20 = ELQ3H4: Supplier 1: LCSC; Supplier Part Number 1: C150957
U21 = MAX3485CSA: Supplier 1: LCSC; Supplier Part Number 1: C1121852